# Altium schematic sheet 05_Buzzer.SchDoc: Buzzer
size A; Date: 4/25/2017; ApprovedBy: JSK; CheckedBy: JSK; Author: JSK; CompanyName: University of Wisconsin; DrawnBy: JSK; Engineer: JSK; Organization: ECE 315; Address1: College of Engineering; Address2: 1415 Engineering Drive; Address3: Madison, WI 53706; Address4: ECE 315 Fall 2017; Revision: A; SheetNumber: 5; SheetTotal: 6; AssemblyNumber: ECE315-F19; ApprovedDate: 04/02/2019
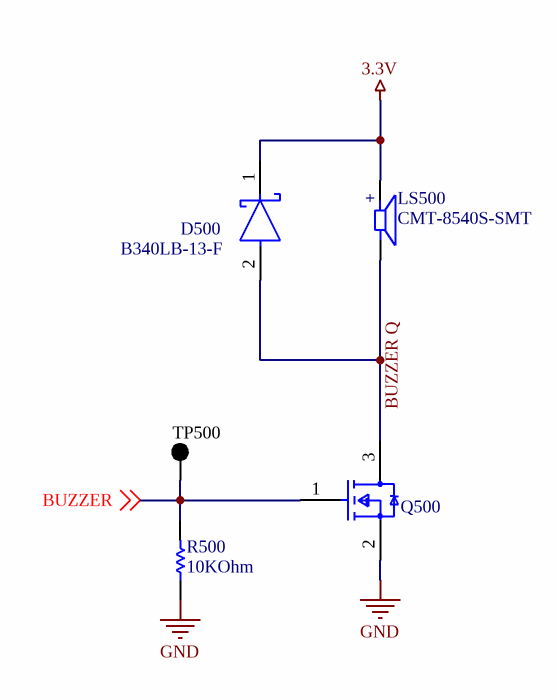
[diagram p0: 05_Buzzer.SchDoc]

## Parts
D500  B340LB-13-F  [FP-SMB-MFG]
LS500  CMT-8540S-SMT  [MBT_Footprint]
Q500  2N7002-7-F  [FP-SOT23-MFG]  (value not drawn)
R500  Resistance: 10KOhm  [RESC3116X65X40ML10T20]  (hidden comment: RC1206FR-0710KL)
TP500  5011  [KSTN-5011_V]  (value not drawn)

## Nets
3.3V: D500.1(C) LS500.P
GND: Q500.2(S) R500.1
BUZZER: Q500.1(G) R500.2 TP500.1 ; off-sheet BUZZER
BUZZER Q: D500.2(A) LS500.N Q500.3(D)

## Notes on the sheet
- Title:
- Size:
- A
- Project
- Rev:
- Sheet:
- of
- College of Engineering
- 1415 Engineering Drive
- Madison, WI 53706
- (in symbol CMT-8540S-SMT) +

## Library data of the parts
D500 = CMP-12790-000022-1: DIODE SCHOTTKY 40V 3A SMB; Manufacturer: Diodes Inc.; Max Surge Forward Current: 70A; Value: 180pF; Peak Reverse Current: 2mA; Standoff Height: 0.05mm; Max Junction Temp: +150°C; Device Class L2: Diodes; Octopart: https://octopart.com/b340lb-13-f-diodes+inc.-325823; Device Class L1: Discrete Semiconductors; Forward Current: 3A; Automotive: No; Manufacturer Part Number: B340LB-13-F; Temperature: -55°C to +150°C; Temperature Range Low: -55°C; Max Repetitive Reverse Voltage: 40V; Device Class L3: Schottky Diodes; RoHS: TRUE; Height: 2.5mm; ComponentLink2URL: https://www.diodes.com/assets/Datasheets/ds30240.pdf; Package: SMB; Digikey Description: DIODE SCHOTTKY 40V 3A SMB; Lead Free: Yes; Category: Diode; Reverse Voltage: 40V; Mouser Description: Schottky Diodes & Rectifiers 40V 3A; ComponentLink2Description: Datasheet; Footprint Url: https://www.diodes.com/assets/Package-Files/SMB.pdf; Temperature Range High: +150°C; Capacitance: 180pF
LS500 = CMT-8540S-SMT: 8.5 mm, 5.0 Vo-p, 100 dB, Surface Mount (SMT), Magnetic Audio Transducer Buzzer; Manufacturer 1: CUI; Manufacturer: Same Sky; MF: CUI Devices; MP: CMT-8540S-SMT-TR; Voltage Rating: 5V; Frequency: 4kHz; Operating Supply Current: 150mA; Shape: Square; CUI_purchase_URL: https://www.cuidevices.com/product/audio/buzzers/audio-transducers/cmt-8540s-smt-tr?utm_source=snapeda.com&utm_medium=referral&utm_campaign=snapedaBOM; SnapEDA_Link: https://www.snapeda.com/parts/CMT-8540S-SMT-TR/CUI%20Devices/view-part/587791/?ref=snap; Availability: Unavailable; Package: CUI Inc.; Value: *; Price: None; Supplier 1: Digi-Key; Supplier Part Number 1: 102-3746-1-ND; Manufacturer Part Number 1: CMT-8540S-SMT-TR; RoHS: Yes; Category: Audio Products; Stock 1: 66147; Pricing 1: 1=3.23000, 10=2.67000, 25=2.46400, 50=2.31400, 100=2.16990, 500=1.91520 (USD); Min Operating Temperature: -20°C; Max Operating Temperature: 70°C; Sensing Method: Magnetic; Lead Free: Lead Free; ComponentLink1URL: https://www.cui.com/product/resource/digikeypdf/cmt-8540s-smt.pdf?src-supplier=Digi-Key; ComponentLink1Description: https://www.cui.com/product/resource/digikeypdf/cmt-8540s-smt.pdf?src-supplier=Digi-Key; Supplier: Arrow Electronics; Supplier Part Number: CMT-8540S-SMT-TR; Manufacturer Part Number: CMT-8540S-SMT-TR; Stock: 8000; Pricing: 1000=1.427 (USD); Height: 4mm; Introduction Date: 2024-09-06; Length: 8.5mm; Lifecycle Status: Production; Mounting Technology: Surface Mount; REACH SVHC: Yes; Schedule B: 8531800040, 8531800040|8531800040, 8531800040|8531800040|8531800040, 8531800040|8531800040|8531800040|8531800040; Width: 8.5mm; ComponentLink2URL: https://datasheet.octopart.com:443/CMT-8540S-SMT-TR-Same-Sky-datasheet-188822742.pdf?src-supplier=Same+Sky; ComponentLink2Description: https://datasheet.octopart.com:443/CMT-8540S-SMT-TR-Same-Sky-datasheet-188822742.pdf?src-supplier=Same+Sky; ComponentLink3URL: https://datasheet.octopart.com:443/CMT-8540S-SMT-TR-Same-Sky-datasheet-181915218.pdf?src-supplier=Same+Sky; ComponentLink3Description: https://datasheet.octopart.com:443/CMT-8540S-SMT-TR-Same-Sky-datasheet-181915218.pdf?src-supplier=Same+Sky; ComponentLink4URL: https://datasheet.octopart.com:443/CMT-8540S-SMT-TR-Same-Sky-datasheet-181915214.pdf?src-supplier=Same+Sky; ComponentLink4Description: https://datasheet.octopart.com:443/CMT-8540S-SMT-TR-Same-Sky-datasheet-181915214.pdf?src-supplier=Same+Sky; ComponentLink5URL: https://datasheet.octopart.com:443/CMT-8540S-SMT-TR-CUI-Devices-datasheet-175924062.pdf?src-supplier=Same+Sky; ComponentLink5Description: https://datasheet.octopart.com:443/CMT-8540S-SMT-TR-CUI-Devices-datasheet-175924062.pdf?src-supplier=Same+Sky; ComponentLink6URL: https://datasheet.octopart.com:443/CMT-8540S-SMT-TR-CUI-Devices-datasheet-137938348.pdf?src-supplier=Same+Sky; ComponentLink6Description: https://datasheet.octopart.com:443/CMT-8540S-SMT-TR-CUI-Devices-datasheet-137938348.pdf?src-supplier=Same+Sky; ComponentLink7URL: https://datasheet.octopart.com:443/CMT-8540S-SMT-TR-Same-Sky-datasheet-190141872.pdf?src-supplier=element14+APAC; ComponentLink7Description: https://datasheet.octopart.com:443/CMT-8540S-SMT-TR-Same-Sky-datasheet-190141872.pdf?src-supplier=element14+APAC; ComponentLink8URL: https://datasheet.octopart.com:443/CMT-8540S-SMT-TR-Same-Sky-datasheet-182879942.pdf?src-supplier=Electro+Sonic; ComponentLink8Description: https://datasheet.octopart.com:443/CMT-8540S-SMT-TR-Same-Sky-datasheet-182879942.pdf?src-supplier=Electro+Sonic; ComponentLink9URL: https://datasheet.octopart.com:443/CMT-8540S-SMT-TR-CUI-Devices-datasheet-175925417.pdf?src-supplier=Master+Electronics; ComponentLink9Description: https://datasheet.octopart.com:443/CMT-8540S-SMT-TR-CUI-Devices-datasheet-175925417.pdf?src-supplier=Master+Electronics; ComponentLink10URL: https://datasheet.octopart.com:443/CMT-8540S-SMT-TR-CUI-Devices-datasheet-140999905.pdf?src-supplier=Master+Electronics; ComponentLink10Description: https://datasheet.octopart.com:443/CMT-8540S-SMT-TR-CUI-Devices-datasheet-140999905.pdf?src-supplier=Master+Electronics; ComponentLink11URL: https://datasheet.octopart.com:443/CMT-8540S-SMT-TR-CUI-Devices-datasheet-103106163.pdf?src-supplier=Master+Electronics; ComponentLink11Description: https://datasheet.octopart.com:443/CMT-8540S-SMT-TR-CUI-Devices-datasheet-103106163.pdf?src-supplier=Master+Electronics; ComponentLink12URL: https://datasheet.octopart.com:443/CMT-8540S-SMT-TR-Same-Sky-datasheet-189104627.pdf?src-supplier=Master+Electronics; ComponentLink12Description: https://datasheet.octopart.com:443/CMT-8540S-SMT-TR-Same-Sky-datasheet-189104627.pdf?src-supplier=Master+Electronics; ComponentLink13URL: https://datasheet.octopart.com:443/CMT-8540S-SMT-TR-Same-Sky-datasheet-188930427.pdf?src-supplier=TME; ComponentLink13Description: https://datasheet.octopart.com:443/CMT-8540S-SMT-TR-Same-Sky-datasheet-188930427.pdf?src-supplier=TME; ComponentLink14URL: https://datasheet.octopart.com:443/CMT-8540S-SMT-TR-Same-Sky-datasheet-182049229.pdf?src-supplier=Future+Electronics; ComponentLink14Description: https://datasheet.octopart.com:443/CMT-8540S-SMT-TR-Same-Sky-datasheet-182049229.pdf?src-supplier=Future+Electronics; ComponentLink15URL: https://datasheet.octopart.com:443/CMT-8540S-SMT-TR-Same-Sky-datasheet-182049228.pdf?src-supplier=Future+Electronics; ComponentLink15Description: https://datasheet.octopart.com:443/CMT-8540S-SMT-TR-Same-Sky-datasheet-182049228.pdf?src-supplier=Future+Electronics; ComponentLink16URL: https://datasheet.octopart.com:443/CMT-8540S-SMT-TR-CUI-Devices-datasheet-175925194.pdf?src-supplier=Future+Electronics; ComponentLink16Description: https://datasheet.octopart.com:443/CMT-8540S-SMT-TR-CUI-Devices-datasheet-175925194.pdf?src-supplier=Future+Electronics; ComponentLink17URL: https://datasheet.octopart.com:443/CMT-8540S-SMT-TR-CUI-Devices-datasheet-140151070.pdf?src-supplier=Future+Electronics; ComponentLink17Description: https://datasheet.octopart.com:443/CMT-8540S-SMT-TR-CUI-Devices-datasheet-140151070.pdf?src-supplier=Future+Electronics; ComponentLink18URL: https://datasheet.octopart.com:443/CMT-8540S-SMT-TR-CUI-Devices-datasheet-175927021.pdf?src-supplier=CUI+Devices+SCT; ComponentLink18Description: https://datasheet.octopart.com:443/CMT-8540S-SMT-TR-CUI-Devices-datasheet-175927021.pdf?src-supplier=CUI+Devices+SCT; ComponentLink19URL: https://datasheet.octopart.com:443/CMT-8540S-SMT-TR-CUI-Devices-datasheet-142348426.pdf?src-supplier=CUI+Devices+SCT; ComponentLink19Description: https://datasheet.octopart.com:443/CMT-8540S-SMT-TR-CUI-Devices-datasheet-142348426.pdf?src-supplier=CUI+Devices+SCT; ComponentLink20URL: https://octopart.com:443/opatz8j6/c1?t=TuT2gNTvJpo_yjRnM7QIcRzfg0x1-xTdTyMxfU2-5t4z1ejkL6PA1jFKuNqkdiWiOSfYO0vvO0p54e5XAzOGaIkHIsr3g49qCyNRee37EbRG1p9GKsoah39OF1Zg1Gz80EG9si1XHmQLLgfWC7KzbsDGlBJlvkgTN80b8dPLQ7E9fPeQcRihUXtqo6YVC6aSoOINB7uzJYK7KUtQWgQHggeFszqcpBhw_xhLRBzDe0ylBNZbwCYqW8v_3NKedSS7Ugfwipe_r_SjQ3v1SR6kXRfBRwb0jh4N92QYN61JqD8Wo72O_FSYd5wFfEYnsPzRXRQyBv1kK3Qx3F7On0xgA1bExSrMbyngCl6rA6Cd&src-supplier=Compliance+Statements; ComponentLink20Description: https://octopart.com:443/opatz8j6/c1?t=TuT2gNTvJpo_yjRnM7QIcRzfg0x1-xTdTyMxfU2-5t4z1ejkL6PA1jFKuNqkdiWiOSfYO0vvO0p54e5XAzOGaIkHIsr3g49qCyNRee37EbRG1p9GKsoah39OF1Zg1Gz80EG9si1XHmQLLgfWC7KzbsDGlBJlvkgTN80b8dPLQ7E9fPeQcRihUXtqo6YVC6aSoOINB7uzJYK7KUtQWgQHggeFszqcpBhw_xhLRBzDe0ylBNZbwCYqW8v_3NKedSS7Ugfwipe_r_SjQ3v1SR6kXRfBRwb0jh4N92QYN61JqD8Wo72O_FSYd5wFfEYnsPzRXRQyBv1kK3Qx3F7On0xgA1bExSrMbyngCl6rA6Cd&src-supplier=Compliance+Statements; ComponentLink21URL: https://octopart.com:443/opatz8j6/c1?t=-w2GoCGQpX4zH2qqt0saqmHF_L2_DJiGJF7AFhdkCk0of-bBcod6T4e_wMdNFwF9tICQRDHBfFEP40JnSh0Ri07gsxTicdoOoQz72w8GHct0sqzxfM9YQ3Ug51fLvc4kpuPXdMJ0lwmmk9g15m3x2rlZXgLpMv25LjTSABL_eYeIFkP--HwPJdHCd4-wvcMMp6cb9lXUq4snrgAEj0Qlf_BK11yy0ExZRztJ5zp5dWebC9gTTPK_Rg_T_Anvyc5OCFxkZP-K8u9fJlPENjcnnWDJ9iY8WcGw0K5sPdYCCUF5QTzXTDnbAkmkb4wzHnWBN85LYTbhtBU1nNVeaP-50RGfX6aIzQ9u2MQT-jDD68Qoug&src-supplier=Compliance+Statements; ComponentLink21Description: https://octopart.com:443/opatz8j6/c1?t=-w2GoCGQpX4zH2qqt0saqmHF_L2_DJiGJF7AFhdkCk0of-bBcod6T4e_wMdNFwF9tICQRDHBfFEP40JnSh0Ri07gsxTicdoOoQz72w8GHct0sqzxfM9YQ3Ug51fLvc4kpuPXdMJ0lwmmk9g15m3x2rlZXgLpMv25LjTSABL_eYeIFkP--HwPJdHCd4-wvcMMp6cb9lXUq4snrgAEj0Qlf_BK11yy0ExZRztJ5zp5dWebC9gTTPK_Rg_T_Anvyc5OCFxkZP-K8u9fJlPENjcnnWDJ9iY8WcGw0K5sPdYCCUF5QTzXTDnbAkmkb4wzHnWBN85LYTbhtBU1nNVeaP-50RGfX6aIzQ9u2MQT-jDD68Qoug&src-supplier=Compliance+Statements; ComponentLink22URL: https://octopart.com:443/opatz8j6/c1?t=DEWJqFhwOSyz_H_REwP9Bf9k-3EkrBXOKtSkjdVkTfQU1-mf8AWbHkGBULwp25c-NbAyZU-d0TOv6aszi-MUttCIYvgOHTczM6OFcH4MT9qHT2EqOHlquyItlLDf08J4rerxoXxwr0TE9QwJbp7kCW8gnIIUvyTQxepN1y8IMW5MP7bhlVkDpt1lOU0K_T8KZ9vKib7VLF1QPBAKGj9ypEcsVqoJUzH46ypG_1kCbAWQxkw9-XDb2CXC4TPpMGUiZX9ecHgV_cRt7HRW6NLn-gmtIJho1C_quWR4T8rckwRYECWGJwTOrudE6RhTXkK1MoqcNtnDLVAdtliNv-h_NT8EekiHfha84-2u-1TD&src-supplier=Compliance+Statements; ComponentLink22Description: https://octopart.com:443/opatz8j6/c1?t=DEWJqFhwOSyz_H_REwP9Bf9k-3EkrBXOKtSkjdVkTfQU1-mf8AWbHkGBULwp25c-NbAyZU-d0TOv6aszi-MUttCIYvgOHTczM6OFcH4MT9qHT2EqOHlquyItlLDf08J4rerxoXxwr0TE9QwJbp7kCW8gnIIUvyTQxepN1y8IMW5MP7bhlVkDpt1lOU0K_T8KZ9vKib7VLF1QPBAKGj9ypEcsVqoJUzH46ypG_1kCbAWQxkw9-XDb2CXC4TPpMGUiZX9ecHgV_cRt7HRW6NLn-gmtIJho1C_quWR4T8rckwRYECWGJwTOrudE6RhTXkK1MoqcNtnDLVAdtliNv-h_NT8EekiHfha84-2u-1TD&src-supplier=Compliance+Statements; ComponentLink23URL: https://octopart.com:443/opatz8j6/c1?t=jWCcU9-kFvbqzH7FA-b8yXQjiAGXcLHMJjku6gw5uolZ388ccMPCd6GO8T7yBdQbJtnCxUYWYjKk6Ufrer_ouEO94Jgx_Izrf5pjDZKgNYEhSmgTnSq9qNsQIZge04OF9OH_pve9O2fLPRIBTKND58KOOTHIUJZETXzsoz4p01ckKyWbhmuYuyEMvH-ZsQdT6wmFz68X4n953Hj-dxnuNxPNndWVNeJ4RO_12vXgbQKdO6i4_fFIKx5FCBxXvG6Qa58jm21I1IS9QSUI55erjCPiFbkVB95jYlYDgLBWhemjfd6pv7MaBNbPlgpKUFh0TUl4FHJHgJ9hFAQ87R40yl1z8QuF1NmEg6gya-npbbEkUg&src-supplier=Compliance+Statements; ComponentLink23Description: https://octopart.com:443/opatz8j6/c1?t=jWCcU9-kFvbqzH7FA-b8yXQjiAGXcLHMJjku6gw5uolZ388ccMPCd6GO8T7yBdQbJtnCxUYWYjKk6Ufrer_ouEO94Jgx_Izrf5pjDZKgNYEhSmgTnSq9qNsQIZge04OF9OH_pve9O2fLPRIBTKND58KOOTHIUJZETXzsoz4p01ckKyWbhmuYuyEMvH-ZsQdT6wmFz68X4n953Hj-dxnuNxPNndWVNeJ4RO_12vXgbQKdO6i4_fFIKx5FCBxXvG6Qa58jm21I1IS9QSUI55erjCPiFbkVB95jYlYDgLBWhemjfd6pv7MaBNbPlgpKUFh0TUl4FHJHgJ9hFAQ87R40yl1z8QuF1NmEg6gya-npbbEkUg&src-supplier=Compliance+Statements; Drawn By: Adam Shebani
Q500 = CMP-2000-04929-2: MOSFET N-CH 60V 115MA SOT23-3; Turn-On Delay Time: 7ns; Turn-Off Delay Time: 11ns; Drain to Source Resistance: 7.5R; Rise Time: 3ns; Drain to Source Breakdown Voltage: 70V; Input Capacitance: 50pF; Number of Elements: 1; Power Dissipation: 540mW; Max Power Dissipation: 300mW; Fall Time: 5.6ns; Gate to Source Voltage (Vgs): 20V; Threshold Voltage: 2.5V; Element Configuration: Single; Termination: SMD/SMT; Weight: 0.000282oz; Radiation Hardening: No; Max Operating Temperature: 150°C; On-State Resistance: 7.5R; Mount: Surface Mount; Current Rating: 115mA; Contact Plating: Tin; Lead Free: Lead Free; Min Operating Temperature: -55°C; Number of Pins: 3; REACH SVHC: No SVHC; Drain to Source Voltage (Vdss): 60V; Width: 1.3mm; Package Quantity: 3000; Length: 2.9mm; Case/Package: SOT-23; Number of Channels: 1; Dual Supply Voltage: 60V; Packaging: Tape and Reel; Height: 1mm; Voltage Rating (DC): 60V; Nominal Vgs: 2.5V; Continuous Drain Current (ID): 115mA; Voltage: 60V; Rds On Max: 7.5R
R500 = CMP-1014-00623-2: Chip Resistor, 10 KOhm, +/- 1%, 0.25 W, -55 to 155 degC, 1206 (3216 Metric), RoHS, Tape and Reel; Manufacturer: Yageo; Voltage Rating: 200V; Temperature Coefficient: 100ppm/degreesC; Power Rating: 250mW; Packaging: TapeandReel; Termination: SMD/SMT; REACH SVHC: Unknown; Tolerance: 1%; Height: 0.55mm; Composition: ThickFilm; Max Operating Temperature: 155degC; Datasheet Version: Rev. 5, 10/2016; Lead Free: LeadFree; Case Code (Metric): 3216; Depth: 1.6mm; Package Quantity: 5000; RoHSCompliant: true; Military Standard: Not; Case/Package: 1206; Case Code (Imperial): 1206; Min Operating Temperature: -55degC; Datasheet URL: http://www.yageo.com/NewPortal/yageodocoutput?fileName=/pdf/R-Chip/PYu-RC_Group_51_RoHS_L_5.pdf; Length: 3.1mm; Manufacturer URL: http://www.yageo.com/; Package Reference: 1206.0; Width: 1.6mm; Package Description: 2-Pin Surface Mount Device, Body 3.1 x 1.6 mm
TP500 = CMP-1672-00003-4: Test Point, Black, Through Hole, RoHS, Bulk; Manufacturer: Keystone; ComponentLink2URL: http://www.keyelco.com/product-pdf.cfm?p=1320; Colour: Black; Pins: 1; REACH SVHC: No SVHC; ComponentLink1URL: http://www.keyelco.com/; PackageReference: 5011; Contact Plating: Silver; Package Quantity: 100; Packaging: Bulk; RoHSCompliant: true; Height: 8.12 mm; PackageDescription: 1-Pin Through Hole Device, Dia 3.17 mm; Mount: Through Hole; Mounting Technology: Through Hole; DatasheetVersion: Rev. F, 12/2013; ComponentLink1Description: Manufacturer URL; Contact Material: Bronze; ComponentLink2Description: Datasheet